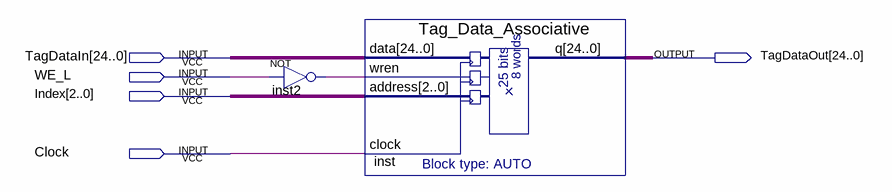
[diagram p0: schematic sheet]
// Quartus schematic TagMemory_Associative.bdf as structural Verilog: 2 symbols, 5 pins
module TagMemory_Associative (
  input  [24:0] TagDataIn,
  input  WE_L,
  input  [2:0] Index,
  input  Clock,
  output [24:0] TagDataOut
);

  wire inst2_out;

  not inst2 (inst2_out, WE_L);
  Tag_Data_Associative inst (.data(TagDataIn), .wren(inst2_out), .address(Index), .clock(Clock), .q(TagDataOut));
endmodule
